# Altium project Tx_Electrode_PA_Power.PrjPcb
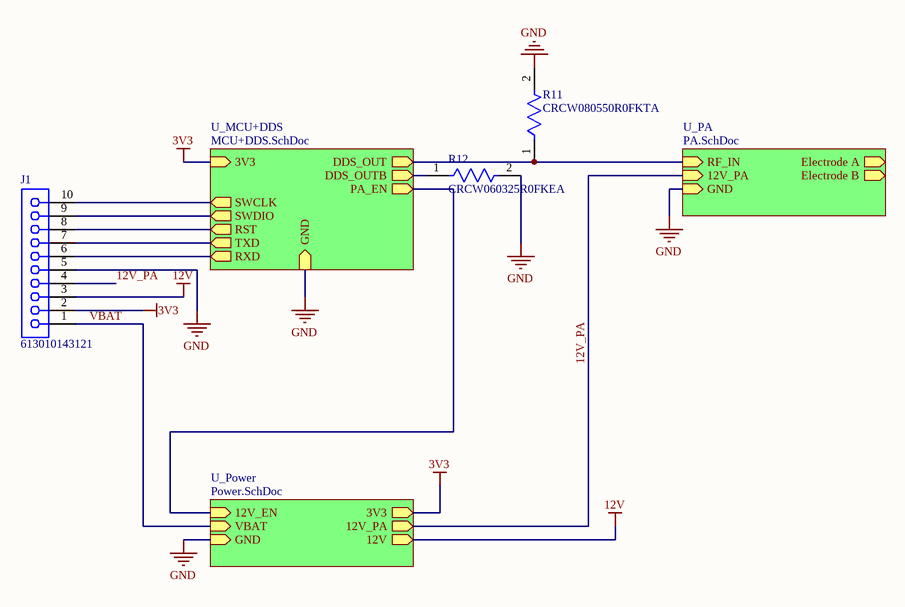
[diagram p0: System.SchDoc]
4 sheets, 65 parts. Net scope: hierarchical (ports join the sheet entries above them; power ports are global).
Board file: PCB1.PcbDoc
Sheets:
  System.SchDoc
    U_PA = PA.SchDoc
    U_MCU+DDS = MCU+DDS.SchDoc
    U_Power = Power.SchDoc

## Sheet System.SchDoc
size A; SheetNumber: 1; SheetTotal: 4

### Parts
J1  613010143121  [613010143121]
R11  CRCW080550R0FKTA  [FP-D12-CRCW0805-MFG]
R12  CRCW060325R0FKEA  [FP-CRCW0603-e3-IPC_B]

### Sub-sheets
U_MCU+DDS = MCU+DDS.SchDoc: 3V3 (in), GND (in), DDS_OUTB (out), DDS_OUT (out), PA_EN (out), SWCLK (out), SWDIO (out), RST (out), TXD (out), RXD (out)
U_PA = PA.SchDoc: RF_IN (in), Electrode A (out), Electrode B (out), 12V_PA (in), GND (in)
U_Power = Power.SchDoc: 12V_EN (in), VBAT (in), 3V3 (out), 12V_PA (out), GND (in), 12V (out)

### Nets
3V3: J1.2 ; sheet U_MCU+DDS/3V3, sheet U_Power/3V3
12V: J1.3 ; sheet U_Power/12V
12V_PA: J1.4 ; sheet U_PA/12V_PA, sheet U_Power/12V_PA
GND: J1.5 R11.2 R12.2 ; sheet U_PA/GND, sheet U_MCU+DDS/GND, sheet U_Power/GND
VBAT: J1.1 ; sheet U_Power/VBAT
DDS_OUT: R11.1 ; sheet U_PA/RF_IN, sheet U_MCU+DDS/DDS_OUT
DDS_OUTB: R12.1 ; sheet U_MCU+DDS/DDS_OUTB
RST: J1.8 ; sheet U_MCU+DDS/RST
RXD: J1.6 ; sheet U_MCU+DDS/RXD
SWCLK: J1.10 ; sheet U_MCU+DDS/SWCLK
SWDIO: J1.9 ; sheet U_MCU+DDS/SWDIO
TXD: J1.7 ; sheet U_MCU+DDS/TXD
NetIC1_3: sheet U_MCU+DDS/PA_EN, sheet U_Power/12V_EN

### Library data of the parts
J1 = CMP-1502-01419-3: NexarPartId: 18818161; Operating Supply Voltage: 250V; Contact Resistance: 20mΩ; Gender: Female; Insulation Resistance: 1GΩ; Connector Type: Header, Socket; Insulation: Insulated; Current Rating: 3A; Number of Positions: 10; Pitch: 2.54mm; Number of Rows: 1; Number of Pins: 10; Voltage Rating: 250V; Length: 25.9mm; Contact Gender: Female; RoHS: Compliant; Contact Plating: Gold; Height: 8.5mm; Min Operating Temperature: -40°C; Contact Material: Copper; Number of Contacts: 10; REACH SVHC: Unknown; Mount: Through Hole; Lead Pitch: 2.54mm; Width: 25.9mm; Max Operating Temperature: 125°C; Flammability Rating: UL94 V-0; Termination: Through Hole; Color: Black; Housing Material: PBT
R11 = CMP-00030-21390498-1: CRCW080550R0FKTA Res Thick Film 0805 50 Ohm 1% 0.125W(1/8W) ±100ppm/C Pad SMD Automotive T/R; Temperature Coefficient: 100ppm/°C; Resistance: 50Ω; Voltage Rating: 150V; Power Rating: 125mW; Length: 2mm; Case Code (Imperial): 0805; Height: 450µm; Contact Plating: Lead, Tin; Width: 1.25mm; Max Operating Temperature: 155°C; NexarPartId: 21390498; Case Code (Metric): 2012; Min Operating Temperature: -55°C; Tolerance: 1%; Case/Package: 0805; Lead Free: Contains Lead; RoHS: Non-Compliant; Composition: Thick Film; Weight: 5.499807mg
R12 = CMP-02407-008643-1: RES Thick Film, 25Ω, 1%, 0.1W, 100ppm/°C, 0603; Resistance: 25R; Power Rating: 100mW; Case/Package: 0603; Lead Free: Lead Free; Tolerance: 1%

## Sheet PA.SchDoc
size A4; SheetNumber: 3; SheetTotal: 4
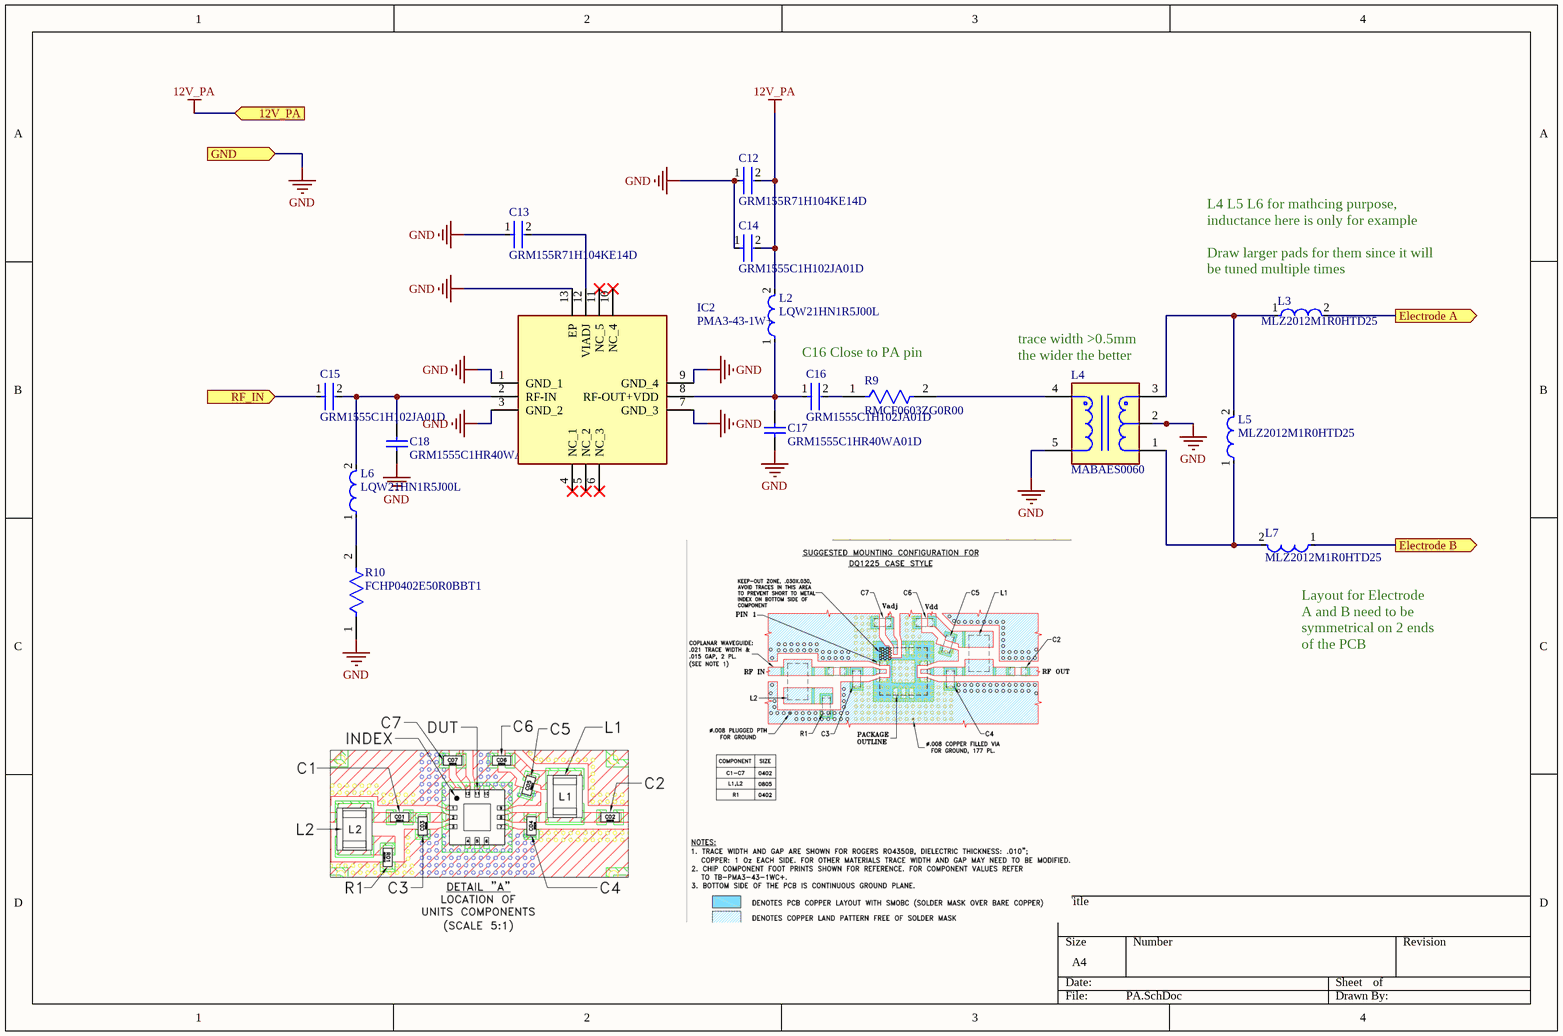
[diagram p1: PA.SchDoc]

### Parts
C12  GRM155R71H104KE14D  [FP-GRM155-0_05-IPC_B]
C13  GRM155R71H104KE14D  [FP-GRM155-0_05-IPC_B]
C14  GRM1555C1H102JA01D  [FP-GRM155-0_05-IPC_B]
C15  GRM1555C1H102JA01D  [FP-GRM155-0_05-IPC_B]
C16  GRM1555C1H102JA01D  [FP-GRM155-0_05-IPC_B]
C17  GRM1555C1HR40WA01D  [CAPC1005X55X25LL05T10]
C18  GRM1555C1HR40WA01D  [CAPC1005X55X25LL05T10]
IC2  PMA3-43-1W+  [QFN51P300X300X89-13N]
L2  LQW21HN1R5J00L  [FP-LQW21HN_00-MFG]
L3  MLZ2012M1R0HTD25  [FP-MLZ2012-1_25-IPC_C]
L4  MABAES0060  [FP-MABAES0060-MFG]
L5  MLZ2012M1R0HTD25  [FP-MLZ2012-1_25-IPC_C]
L6  LQW21HN1R5J00L  [FP-LQW21HN_00-MFG]
L7  MLZ2012M1R0HTD25  [FP-MLZ2012-1_25-IPC_C]
R9  RMCF0603ZG0R00  [FP-RMCF0603-IPC_B]
R10  FCHP0402E50R0BBT1  [FP-FC0402-MFG]

### Ports
12V_PA (in), Electrode A (out), Electrode B (out), GND (in), RF_IN (in)

### Nets
12V_PA: C12.2 C14.2 L2.2 ; port 12V_PA
GND: C12.1 C13.1 C14.1 C17.1 C18.1 IC2.1(GND_1) IC2.3(GND_2) IC2.7(GND_3) IC2.9(GND_4) IC2.13(EP) L4.2(Secondary_CT) L4.5(Primary) R10.1 ; port GND
DDS_OUT: C15.1 ; port RF_IN
NetC13_2: C13.2 IC2.12(VIADJ)
NetC15_2: C15.2 C18.2 IC2.2(RF-IN) L6.2
NetC16_1: C16.1 C17.2 IC2.8(RF-OUT+VDD) L2.1
NetC16_2: C16.2 R9.1
NetL3_1: L3.1 L4.3(Secondary_Dot) L5.2
NetL3_2: L3.2 ; port Electrode A
NetL4_1: L4.1(Secondary) L5.1 L7.2
NetL4_4: L4.4(Primary_dot) R9.2
NetL6_1: L6.1 R10.2
NetL7_1: L7.1 ; port Electrode B

Not connected (* = marked no-connect by the designer): IC2 4(NC_1)* 5(NC_2)* 6(NC_3)* 10(NC_4)* 11(NC_5)*

### Notes on the sheet
- (near L3) L4 L5 L6 for mathcing purpose, inductance here is only for example
  Draw larger pads for them since it will be tuned multiple times
- C16 Close to PA pin
- (near L4) trace width >0.5mm the wider the better
- (near L7) Layout for Electrode A and B need to be symmetrical on 2 ends of the PCB

### Library data of the parts
C12 C13 = CMP-2008-04639-2: Chip Multilayer Ceramic Capacitors for General Purpose, 0402, 0.10uF, X7R, 15%, 10%, 50V; Dissipation Factor: 0.025%; Capacitance: 100nF; Weight: 0.000212oz; Thickness: 0.022inch; Voltage Rating (DC): 50V; Dielectric Material: Ceramic; Termination: SMD/SMT; Case/Package: 0402; Case Code (Imperial): 0402; Mount: Surface Mount; REACH SVHC: No SVHC; Resistor Type: Ceramic; Dielectric: X7R; Max Operating Temperature: 125°C; Voltage: 50V; Lead Free: Lead Free; Package Quantity: 10000; Packaging: Tape and Reel; Length: 1mm; Material: Ceramic; Height: 0.5mm; Depth: 0.5mm; Width: 0.5mm; Min Operating Temperature: -55°C; Tolerance: 10%; Case Code (Metric): 1005; Voltage Rating: 50V
C14-C16 = CMP-2008-04254-2: Chip Multilayer Ceramic Capacitors for General Purpose, 0402, 1000pF, C0G, 30ppm/°C, 5%, 50V; Insulation Resistance: 10GR; Capacitance: 1nF; Packaging: Tape and Reel; Lead Free: Lead Free; Tolerance: 5%; Temperature Coefficient: 30ppm/°C; Thickness: 0.022inch; Termination: SMD/SMT; Max Operating Temperature: 125°C; Height: 0.5mm; Package Quantity: 1; Radiation Hardening: No; Material: Ceramic; Case Code (Metric): 1005; Number of Pins: 2; Voltage Rating: 50V; Mount: Surface Mount; Voltage: 50V; Case/Package: 0402; Min Operating Temperature: -55°C; Dielectric Material: Ceramic; Width: 0.5mm; Depth: 0.5mm; Case Code (Imperial): 0402; REACH SVHC: No SVHC; Dielectric: C0G; Voltage Rating (DC): 50V; Length: 1mm
C17 C18 = CMP-1034-00010-2: Manufacturer: Murata; Part Number: GRM1555C1HR40WA01D
IC2 = PMA3-43-1W+: Integrated Circuit; Manufacturer_Name: Mini-Circuits; Datasheet Link: https://www.minicircuits.com/pdfs/PMA3-43-1W+.pdf; Height: 0.89mm; Manufacturer_Part_Number: PMA3-43-1W+
L2 L6 = CMP-06042-001639-1: Wire Wound Ferrite type RF Inuctor 1.5uH ±5% 85mA 5.33Ω 0805 (2012); DC Resistance (DCR): 5.33R; Self Resonant Frequency: 350MHz; Shielding: Unshielded; Test Frequency: 10MHz; Q Factor: 35; Width: 0.047inch; Core Material: Ferrite; Case Code (Metric): 2012; DC Current: 85mA; Current Rating: 85mA; Mount: Surface Mount; Max DC Current: 85mA; Length: 2mm; Height - Seated (Max): 0.039inch; Depth: 1.4mm; Min Operating Temperature: -40°C; Termination: SMD/SMT; Military Standard: Not; Radiation Hardening: No; Packaging: Tape and Reel; Resistor Type: Wirewound; Case/Package: 0805; Case Code (Imperial): 0805; Inductance: 1.5uH; Weight: 0.000282oz; Height: 0.9mm; Package Quantity: 3000; Max Operating Temperature: 85°C; Tolerance: 5%
L3 L5 L7 = CMP-08253-000383-1: Shielded Multilayer Inductor 1uH ±20% 800mA 130mΩ AEC-Q200 SMD 0805; Core Material: Ferrite; Test Frequency: 2MHz; DC Resistance (DCR): 130mR; Saturation Current: 700mA; Height: 1.25mm; Min Operating Temperature: -55°C; Max DC Current: 800mA; Mount: Surface Mount; Height - Seated (Max): 0.057inch; Tolerance: 20%; Package Quantity: 2000; Case/Package: 0805; Current Rating: 800mA; Inductance: 1uH; Case Code (Metric): 2012; Max Operating Temperature: 125°C; RoHS Compliant: Yes; Case Code (Imperial): 0805; Shielding: Shielded; Ratings: AEC-Q200; Length: 0.079inch; Termination: SMD/SMT; Packaging: Tape and Reel; Width: 0.049inch; Weight: 0.000194oz
L4 = CMP-97513-000003-1: BALUN 300KHZ-200MHZ 1:1 6SMD; Insertion Loss: 1.5dB; Lead/Base Style: Gull Wing; Max DC Current: 500mA; Power Rating: 500mW; Package Quantity: 2000; Lead Free: Lead Free; Case/Package: SMD/SMT; Number of Pins: 5; Width: 3.81mm; Turns Ratio: 1:1; Depth: 3.81mm; Height: 2.67mm; Min Operating Temperature: -40°C; Termination: SMD/SMT; Length: 3.81mm; Max Operating Temperature: 85°C; Packaging: Tape and Reel; Radiation Hardening: No; Mount: Surface Mount
R9 = CMP-26527-006412-1: 0Ω ±0 0.1W 0603 Thick Film Chip Resistor AEC-Q200 compliant; Max Power Dissipation: 100mW; Resistance: 0R; Width: 0.031inch; RoHS Compliant: Yes; Number of Terminations: 2; Case/Package: 0603; Contact Plating: Tin; Height: 0.022inch; Resistor Type: Thick Film; Mount: Surface Mount; Length: 0.061inch; Features: Automotive AEC-Q200; Series: RMCF; Max Operating Temperature: 155°C; Radiation Hardening: No; Min Operating Temperature: -55°C; Packaging: Tape and Reel
R10 = CMP-05494-120702529-1: FCHP0402E50R0BBT1 SMD Chip Resistor, 50 Ohm, ± 0.1%, 1 W, 0402 [1005 Metric], Thin Film, High Frequency; Power Rating: 1W; Voltage Rating: 30V; Temperature Coefficient: 25ppm/°C; Resistance: 50Ω; Max Operating Temperature: 155°C; Min Operating Temperature: -55°C; Composition: Thin Film; Schedule B: 8533210045; Case/Package: 0402; Tolerance: 0.1%; Height: 419.1µm; NexarPartId: 120702529

## Sheet MCU+DDS.SchDoc
size A; SheetNumber: 2; SheetTotal: 4
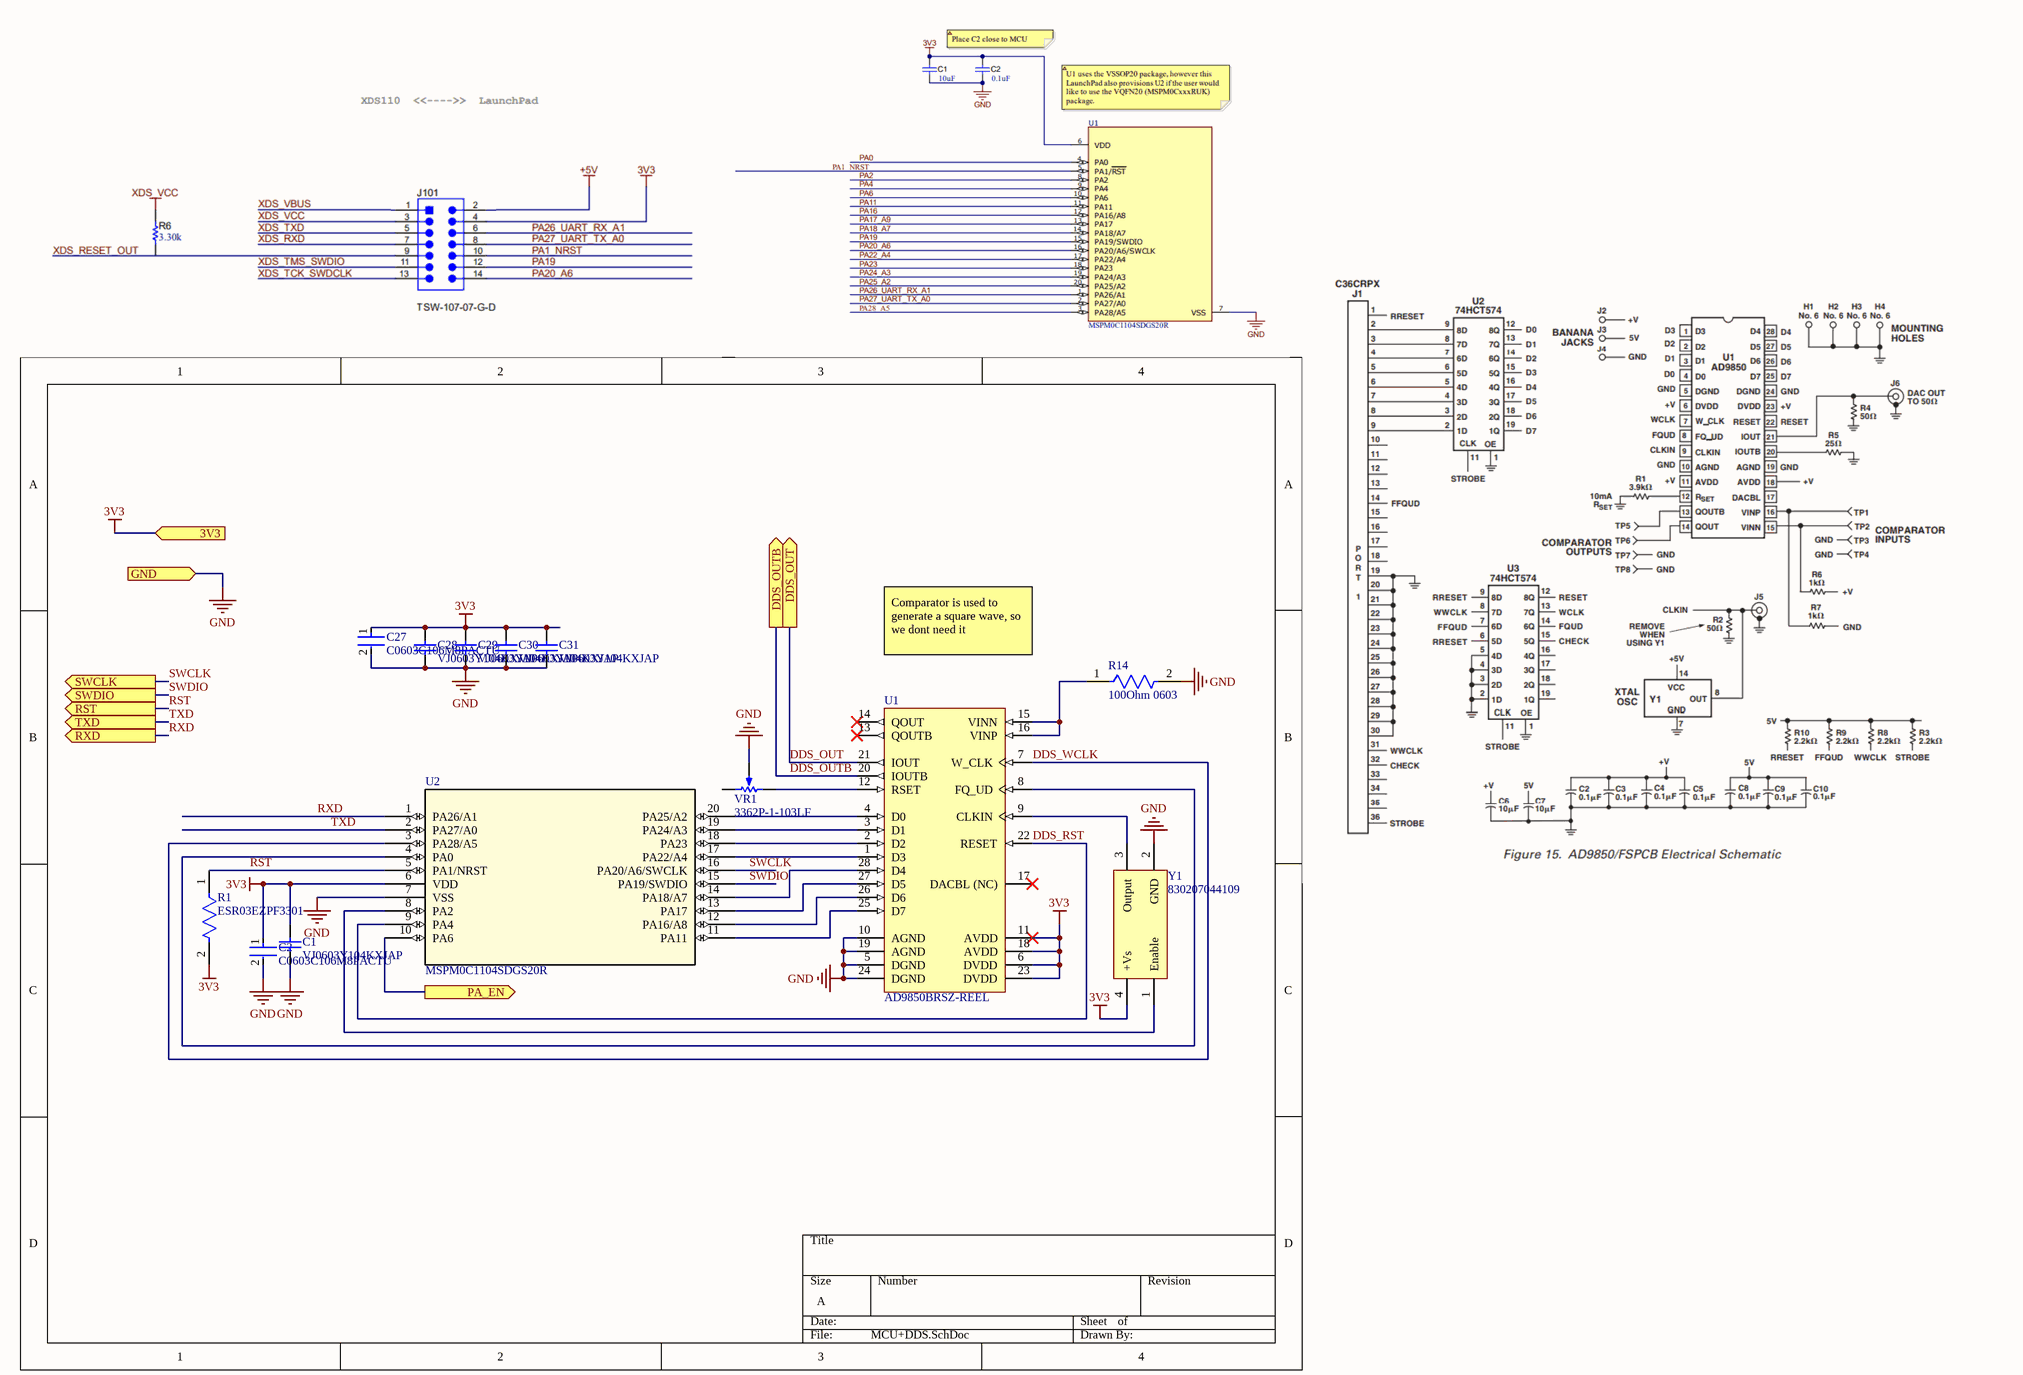
[diagram p2: MCU+DDS.SchDoc]

### Parts
(Parts that share a designator on the sheet are numbered #1, #2 ... from top to bottom, then left to right.)
C1#1  VJ0603Y104KXJAP  [CAPC1608X92X38NL15T08]
C2#1  C0603C106M8PACTU  [FP-C0603C106M8PACTU-MFG]
C27  C0603C106M8PACTU  [FP-C0603C106M8PACTU-MFG]
C28  VJ0603Y104KXJAP  [CAPC1608X92X38NL15T08]
C29  VJ0603Y104KXJAP  [CAPC1608X92X38NL15T08]
C30  VJ0603Y104KXJAP  [CAPC1608X92X38NL15T08]
C31  VJ0603Y104KXJAP  [CAPC1608X92X38NL15T08]
R1#1  ESR03EZPF3301  [FP-ESR03-IPC_A]
R14  100Ohm 0603  [FP-CRCW0603-e3-IPC_B]
U1#1  AD9850BRSZ-REEL  [ADI-RS-28_N]
U2  MSPM0C1104SDGS20R  [DGS0020A_TEX]
VR1  3362P-1-103LF  [BOUR-3362P]
Y1  830207044109  [WE-SPXO_CFPS-39]

### Ports
3V3 (in), DDS_OUT (out), DDS_OUTB (out), GND (in), PA_EN (out), RST (out), RXD (out), SWCLK (out), SWDIO (out), TXD (out)

### Nets
3V3: C1#1.2 C2#1.1 C27.1 C28.2 C29.2 C30.2 C31.2 R1#1.2 U1#1.6(DVDD) U1#1.11(AVDD) U1#1.18(AVDD) U1#1.23(DVDD) U2.6(VDD) Y1.4(+Vs) ; port 3V3
GND: C1#1.1 C2#1.2 C27.2 C28.1 C29.1 C30.1 C31.1 R14.2 U1#1.5(DGND) U1#1.10(AGND) U1#1.19(AGND) U1#1.24(DGND) U2.7(VSS) VR1.2(S) Y1.2(GND) ; port GND
DDS_OUT: U1#1.21(IOUT) ; port DDS_OUT
DDS_OUTB: U1#1.20(IOUTB) ; port DDS_OUTB
DDS_RST: U1#1.22(RESET) U2.9(PA4)
DDS_WCLK: U1#1.7(W_CLK) U2.3(PA28/A5)
RST: R1#1.1 U2.5(PA1/NRST) ; port RST
RXD: U2.1(PA26/A1) ; port RXD
SWCLK: U2.16(PA20/A6/SWCLK) ; port SWCLK
SWDIO: U2.15(PA19/SWDIO) ; port SWDIO
TXD: U2.2(PA27/A0) ; port TXD
NetIC1_3: U2.10(PA6) ; port PA_EN
NetR14_1: R14.1 U1#1.15(VINN) U1#1.16(VINP)
NetU1#1_1: U1#1.1(D3) U2.17(PA22/A4)
NetU1#1_2: U1#1.2(D2) U2.18(PA23)
NetU1#1_3: U1#1.3(D1) U2.19(PA24/A3)
NetU1#1_4: U1#1.4(D0) U2.20(PA25/A2)
NetU1#1_8: U1#1.8(FQ_UD) U2.4(PA0)
NetU1#1_9: U1#1.9(CLKIN) Y1.3(Output)
NetU1#1_12: U1#1.12(RSET) VR1.1(CCW)
NetU1#1_25: U1#1.25(D7) U2.11(PA11)
NetU1#1_26: U1#1.26(D6) U2.12(PA16/A8)
NetU1#1_27: U1#1.27(D5) U2.13(PA17)
NetU1#1_28: U1#1.28(D4) U2.14(PA18/A7)
NetU2_8: U2.8(PA2) Y1.1(Enable)

Not connected (* = marked no-connect by the designer): U1#1 13(QOUTB)* 14(QOUT)* 17(DACBL_(NC))*; VR1 3(CW)

### Notes on the sheet
- Comparator is used to generate a square wave, so we dont need it

### Library data of the parts
C1#1 C28-C31 = CMP-2006-01211-1: Manufacturer: Vitramon; Part Number: VJ0603Y104KXJAP
C2#1 C27 = CMP-03020-034654-1: CAP CER 10UF 10V X5R 0603; RoHS Compliant: Yes
R1#1 = CMP-08839-028747-1: 3.3kΩ ±1% 0.25W 0603 Anti-Surge Chip Resistor AEC-Q200; Temperature Coefficient: 100ppm/°C; Resistance: 3.3kR; Max Power Dissipation: 250mW; Tolerance: 1%; Min Operating Temperature: -55°C; Features: Automotive AEC-Q200; Max Operating Temperature: 155°C; Number of Terminations: 2; Series: ESR; Packaging: Tape and Reel; Resistor Type: Thick Film; RoHS Compliant: Yes; Case/Package: 0603
R14 = CMP-2000-03097-2: Voltage Rating: 75V; Temperature Coefficient: 100ppm/°C; Power Rating: 100mW; Resistance: 22R; Tolerance: 1%; Lead Free: Lead Free; Height: 0.45mm; Package Quantity: 5000; Weight: 7.1E-05oz; Width: 0.85mm; Length: 1.55mm; Mount: Surface Mount; Packaging: Tape and Reel; Termination: SMD/SMT; Case/Package: 0603; Case Code (Metric): 1608; Radiation Hardening: No; Max Operating Temperature: 155°C; Military Standard: Not; Min Operating Temperature: -55°C; Case Code (Imperial): 0603; Contact Plating: Tin; Voltage Rating (DC): 75V; Depth: 0.85mm; Composition: Thick Film
U1#1 = CMP-0293-00041-1: CMOS, 125 MHz Complete DDS Synthesizer, 10-Bit, Parallel, Serial, RS-28, 1500 Reel, Pb-Free; Tuning Word Width (bits): 32bit; Master fclk: 125MHz; Resolution (Bits): 10bit; REFCLK Multiplier: No; Compliance Range (V): 1.5V; FS Iout (mA nom): 20mA; I Supply total (max): 96mA; ComponentLink3Description: Package Specification; Code_JEDEC: MO-150-AH; ComponentLink1URL: www.analog.com; I/O Interface: Parallel, Serial; PackageDescription: 28-Lead Shrink Small Outline Package [SSOP]; ComponentLink2URL: http://www.analog.com/static/imported-files/data_sheets/AD9850.pdf; ComponentLink3URL: http://www.analog.com/static/imported-files/packages/32122249223724RS_28.pdf; ComponentLink2Description: Datasheet; PackageVersion: revA, 1997; ComponentLink1Description: Manufacturer URL; PackageReference: RS-28; DatasheetVersion: Rev. H
U2 = MSPM0C1104SDGS20R: 24MHz ArmÂ® CortexÂ®-M0+ MCU with 16KB flash, 1KB SRAM, 12-bit ADC 20-VSSOP -40 to 125; Manufacturer_Name: Texas Instruments; Copyright: Copyright (C) 2025 Ultra Librarian. All rights reserved.; Manufacturer_Part_Number: MSPM0C1104SDGS20R; Datasheet: https://www.ti.com/lit/gpn/mspm0c1104; RefDes: RefDes; Type: Type
VR1 = CMP-1747-00004-1: Square Trimpot(R) Trimming Potentiometer, 10 KOhm, 300 V, -55 to 125 degC, 3-Pin THD, RoHS, Tube; Voltage Rating: 220 mV; Power Rating: 1 W; Tolerance: 1%; Resistance: 50 mohm; Case/Package: 1206; Length: 3.2 mm; RoHSCompliant: True; PackageDescription: 3-Pin Through Hole Device, Body 6.6 x 6.99 mm, Pitch 2.54 mm; ComponentLink2Description: Datasheet; REACH SVHC: No SVHC; Mount: Surface Mount; Height: 0.6 mm; Packaging: Tape and Reel; ComponentLink1URL: http://www.bourns.com/; Case Code (Imperial): 0612; Pins: 2; Case Code (Metric): 1632; ComponentLink2URL: http://www.bourns.com/docs/Product-Datasheets/3362.pdf; Min Operating Temperature: -25degC; ComponentLink1Description: Manufacturer URL; PackageReference: 3326P; Max Operating Temperature: 125degC; Width: 1.6 mm; Package Quantity: 5000; DatasheetVersion: May-16
Y1 = CMP-03913-116855802-1: 830207044109 WE-SPXO Crystal Oscillator; Frequency: 100MHz; NexarPartId: 116855802; Length: 3.2mm; Width: 2.5mm; Max Operating Temperature: 85°C; Height: 1.2mm; Min Operating Temperature: -40°C

## Sheet Power.SchDoc
size A4; SheetNumber: 4; SheetTotal: 4
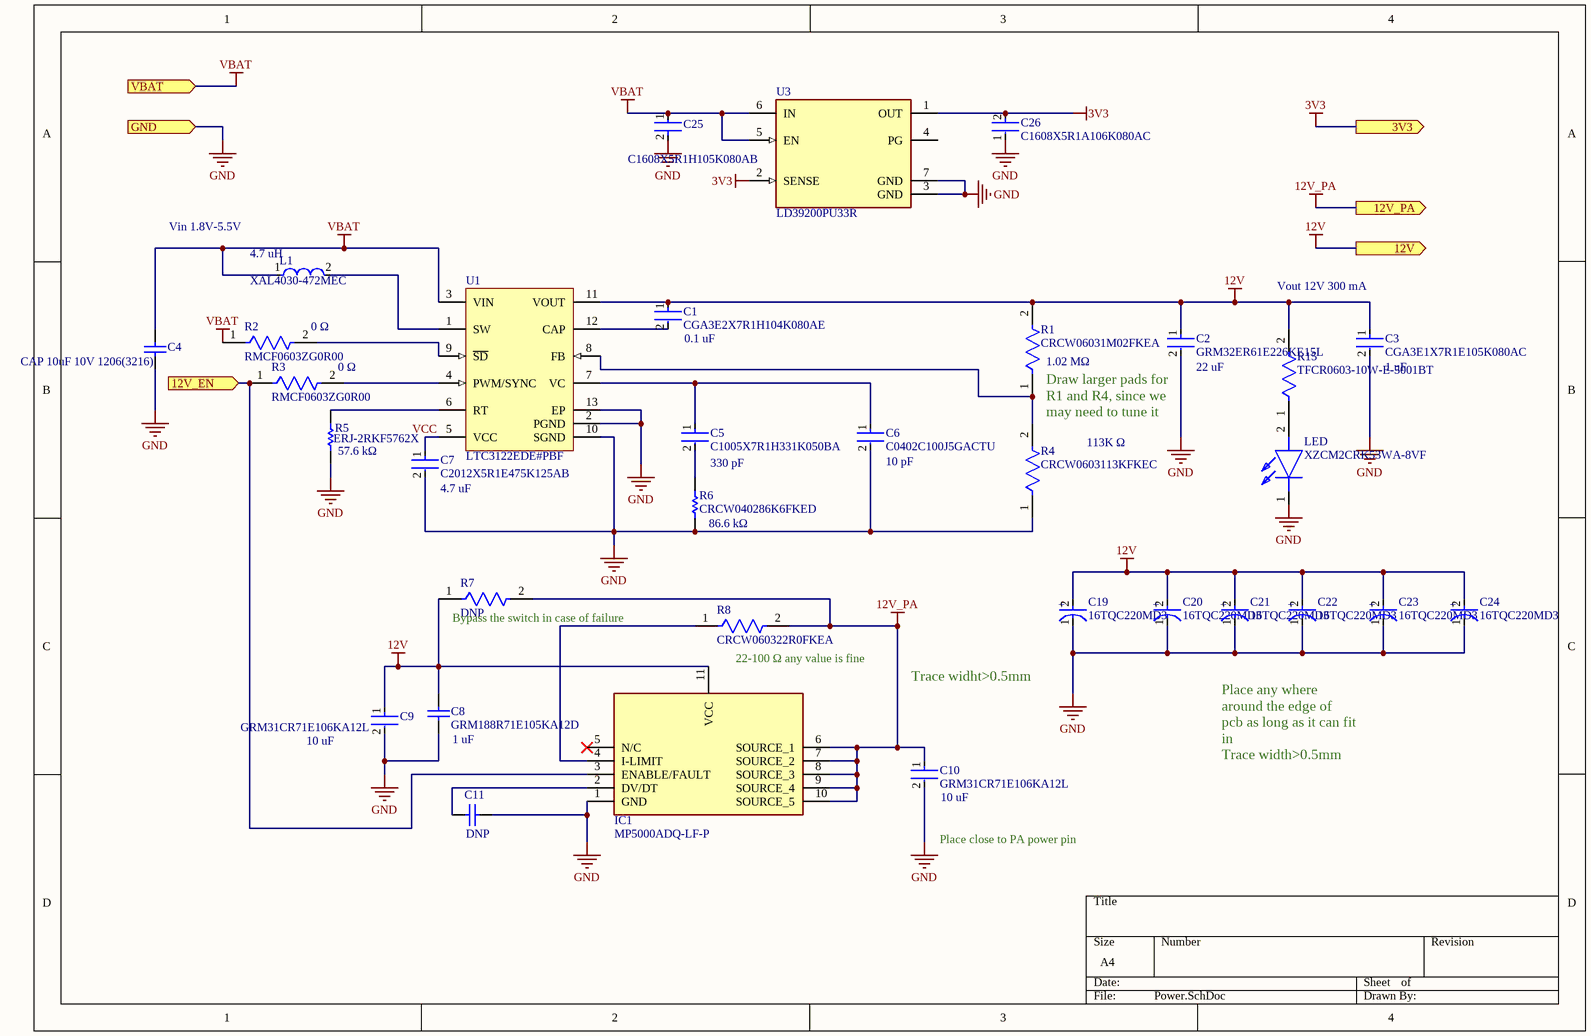
[diagram p3: Power.SchDoc]

### Parts
(Parts that share a designator on the sheet are numbered #1, #2 ... from top to bottom, then left to right.)
C1#2  CGA3E2X7R1H104K080AE  [FP-CGA3E-0_3-0_1-IPC_A]
C2#2  GRM32ER61E226KE15L  [FP-GRM32-MFG]
C3  CGA3E1X7R1E105K080AC  [FP-CGA3E-0_3-0_1-IPC_A]
C4  CAP 10uF 10V 1206(3216)  [CAPC1206(3216)190_L]
C5  C1005X7R1H331K050BA  [FP-C1005-050-0_05-IPC_B]
C6  C0402C100J5GACTU  [FP-C0402-BB-MFG]
C7  C2012X5R1E475K125AB  [FP-C2012-125-0_2-MFG]
C8  GRM188R71E105KA12D  [CAPC1608X90X35ML10T15]
C9  GRM31CR71E106KA12L  [FP-GRM31C-0_2-e0_3_0_8-MFG]
C10  GRM31CR71E106KA12L  [FP-GRM31C-0_2-e0_3_0_8-MFG]
C11  DNP  [CAPC1608X90X35NL10T15]
C19  16TQC220MD3  [FP-POSCAP-D3L-MFG]
C20  16TQC220MD3  [FP-POSCAP-D3L-MFG]
C21  16TQC220MD3  [FP-POSCAP-D3L-MFG]
C22  16TQC220MD3  [FP-POSCAP-D3L-MFG]
C23  16TQC220MD3  [FP-POSCAP-D3L-MFG]
C24  16TQC220MD3  [FP-POSCAP-D3L-MFG]
C25  C1608X5R1H105K080AB  [FP-C1608-080-0_1-IPC_B]
C26  C1608X5R1A106K080AC  [FP-C1608-080-0_1-MFG]
IC1  MP5000ADQ-LF-P  [SON50P300X300X100-11N-D]
L1  XAL4030-472MEC  [FP-XAL4030-472MEC-MFG]
LED  XZCM2CRK53WA-8VF  [XZCFBB53W8VF]
R1#2  CRCW06031M02FKEA  [FP-CRCW0603-e3-IPC_A]
R2  RMCF0603ZG0R00  [FP-RMCF0603-IPC_B]
R3  RMCF0603ZG0R00  [FP-RMCF0603-IPC_B]
R4  CRCW0603113KFKEC  [FP-CRCW0603-e3-MFG]
R5  ERJ-2RKF5762X  [RESC1005X40X25NL05T05]
R6  CRCW040286K6FKED  [RESC1005X40X25NL05T05]
R7  DNP  [FP-RMCF0603-IPC_B]
R8  CRCW060322R0FKEA  [FP-CRCW0603-e3-IPC_B]
R15  TFCR0603-10W-E-5001BT  [FP-TFCR0603-IPC_C]
U1#2  LTC3122EDE#PBF  [LT-DE-UE-12_V]
U3  LD39200PU33R  [FP-DFN6-7946637-MFG]

### Ports
3V3 (out), 12V (out), 12V_EN (in), 12V_PA (out), GND (in), VBAT (in)

### Nets
3V3: C26.2 U3.1(OUT) U3.2(SENSE) ; port 3V3
12V: C1#2.1 C2#2.1 C3.1 C8.2 C9.1 C19.2(A) C20.2(A) C21.2(A) C22.2(A) C23.2(A) C24.2(A) IC1.11(VCC) R1#2.2 R7.1 R15.2 U1#2.11(VOUT) ; port 12V
12V_PA: C10.1 IC1.6(SOURCE_1) IC1.7(SOURCE_2) IC1.8(SOURCE_3) IC1.9(SOURCE_4) IC1.10(SOURCE_5) R7.2 R8.2 ; port 12V_PA
GND: C2#2.2 C3.2 C4.1 C6.2 C7.2 C8.1 C9.2 C10.2 C11.1 C19.1(C) C20.1(C) C21.1(C) C22.1(C) C23.1(C) C24.1(C) C25.2 C26.1 IC1.1(GND) LED.1(K) R4.1 R5.1 R6.1 U1#2.2(PGND) U1#2.10(SGND) U1#2.13(EP) U3.3(GND) U3.7(GND) ; port GND
VBAT: C4.2 C25.1 L1.1 R2.1 U1#2.3(VIN) U3.5(EN) U3.6(IN) ; port VBAT
VCC: C7.1 U1#2.5(VCC)
NetC1#2_2: C1#2.2 U1#2.12(CAP)
NetC5_1: C5.1 C6.1 U1#2.7(VC)
NetC5_2: C5.2 R6.2
NetC11_2: C11.2 IC1.2(DV/DT)
NetIC1_3: IC1.3(ENABLE/FAULT) R3.1 ; port 12V_EN
NetIC1_4: IC1.4(I-LIMIT) R8.1
NetL1_2: L1.2 U1#2.1(SW)
NetLED_2: LED.2(A) R15.1
NetR1#2_1: R1#2.1 R4.2 U1#2.8(FB)
NetR2_2: R2.2 U1#2.9(~{SD})
NetR3_2: R3.2 U1#2.4(PWM/SYNC)
NetR5_2: R5.2 U1#2.6(RT)

Not connected (* = marked no-connect by the designer): IC1 5(N/C)*; U3 4(PG)

### Notes on the sheet
- Vin 1.8V-5.5V
- (near L1) 4.7 uH
- Vout 12V 300 mA
- (near R2) 0 Ω
- (near R3) 0 Ω
- (near C1#2) 0.1 uF
- (near R1#2) 1.02 MΩ
- (near C2#2) 22 uF
- (near C3) 1 uF
- Draw larger pads for R1 and R4, since we may need to tune it
- 113K Ω
- (near R5) 57.6 kΩ
- (near C7) 4.7 uF
- 330 pF
- (near C6) 10 pF
- (near R6) 86.6 kΩ
- (near R7) Bypass the switch in case of failure
- 22-100 Ω any value is fine
- Trace widht>0.5mm
- (near C9) 10 uF
- (near C8) 1 uF
- Place any where around the edge of pcb as long as it can fit in
  Trace width>0.5mm
- Place close to PA power pin
- (near C10) 10 uF
- (in symbol CMP-05428-000297-1) +

### Library data of the parts
C1#2 = CMP-08246-002410-1: Cap Ceramic 100nF 50V X7R 10% Pad SMD 0603 +125°C Automotive T/R; Thickness: 0.035inch; Dielectric: X7R; Height: 0.8mm; Min Operating Temperature: -55°C; Package Quantity: 4000; Voltage Rating: 50V; Voltage Rating (DC): 50V; Lead Free: Lead Free; Case Code (Metric): 1608; Ratings: AEC-Q200; Capacitance: 100nF; Length: 0.063inch; Width: 0.8mm; Weight: 7.1E-05oz; Case/Package: 0603; Case Code (Imperial): 0603; Termination: SMD/SMT; Mount: Surface Mount; Packaging: Tape and Reel; Max Operating Temperature: 125°C; Tolerance: 10%; Features: Soft Termination
C2#2 = CMP-2000-05458-2: CAP CER 22UF 25V X5R 1210; Manufacturer: Murata Electronics North America; Possible Substitute: GRM32ER61E226KE15K; Other Names: 490-3889-2; Material: Ceramic; Tolerance: 10%; Digikey Description: CAP CER 22UF 25V X5R 1210; Mouser Description: Multilayer Ceramic Capacitors MLCC - SMD/SMT 1210 22uF 25volts X5R 10%; Device Class L2: Capacitors; Height: 2.7mm; Temperature Characteristic: X5R; Category: Cap; RoHS: TRUE; Operating Temperature: -55°C ~ 85°C; Temperature: -55°C to +85°C; Lead Free: Yes; Package: GRM32; Temperature Range High: +85°C; Package / Case: 1210 (3225 Metric); Standard Package: 1,000; Packaging: Cut Tape (CT); Capacitance: 22uF; Thickness (Max): 0.106" (2.70mm); Value: 22uF; Automotive: No; Device Class L1: Passive Components; Voltage - Rated: 25V; Temperature Range Low: -55°C; Size / Dimension: 0.126" L x 0.098" W (3.20mm x 2.50mm); ComponentLink2Description: Datasheet; Device Class L3: Ceramic Capacitors; Temperature Coefficient: X5R; ComponentLink2URL: https://search.murata.co.jp/Ceramy/image/img/A01X/G101/ENG/GRM32ER61E226KE15-01A.pdf; Voltage Rating: 25V; Manufacturer Part Number: GRM32ER61E226KE15L; Octopart: https://octopart.com/grm32er61e226ke15l-murata-197441; Applications: General Purpose; Mounting Type: Surface Mount, MLCC
C3 = CMP-08246-001507-1: Cap Ceramic 1uF 25V X7R 10% Pad SMD 0603 +125°C Automotive T/R; Dielectric: X7R; Capacitance: 1uF; Voltage Rating: 25V; Thickness: 0.035inch; Width: 0.031inch; Ratings: AEC-Q200; Case Code (Metric): 1608; REACH SVHC: No SVHC; Voltage: 25V; Composition: Ceramic; Min Operating Temperature: -55°C; Termination: SMD/SMT; Depth: 0.8mm; Max Operating Temperature: 125°C; Mount: Surface Mount; Weight: 7.1E-05oz; Package Quantity: 4000; Tolerance: 10%; Packaging: Tape and Reel; Lead Free: Lead Free; Case/Package: 0603; Length: 1.6mm; Height: 0.8mm; Case Code (Imperial): 0603; Voltage Rating (DC): 25V
C4 = CMP-1037-04967-1: CAP 10uF 10V ±10% 1206 (3216 Metric) Thickness 1.9mm SMD; Tolerance: Â±10%; Case-Metric: 3216; Case-EIA: 1206; Rated Voltage: 10 V; Max Thickness: 1.9 mm; Technology: SMT; Value: 10uF
C5 = CMP-08246-002681-1: Multilayer Ceramic Capacitors 330pF ±10% 50V X7R SMD 0402; Height: 0.5mm; Min Operating Temperature: -55°C; Construction: Flat; Voltage Rating (DC): 50V; Depth: 0.5mm; Number of Pins: 2; Capacitance: 330pF; Case/Package: 0402; REACH SVHC: No SVHC; Lead Free: Lead Free; Thickness: 0.022inch; Package Quantity: 1; Case Code (Imperial): 0402; Max Operating Temperature: 125°C; RoHS Compliant: Yes; Voltage Rating: 50V; Length: 1mm; Weight: 2.3E-05oz; Width: 0.02inch; Case Code (Metric): 1005; Dielectric Material: Ceramic; Tolerance: 10%; Mount: Surface Mount; Dielectric: X7R; Series: C; Resistor Type: Ceramic; Termination: SMD/SMT; Packaging: Tape and Reel
C6 = CMP-2008-03404-2: Multilayer Ceramic Capacitor, C Series, 10 Pf, - 5%, C0G / Np0, 50 V, 0402 [1005 Metric] Rohs Compliant: Yes; Manufacturer: Kemet; Temperature Coefficient: 15%; Voltage Rating: 50 V; Capacitance: 10 pF; Value: 10 pF; Tolerance: 0.05; Automotive: No; Temperature Range High: +125°C; ComponentLink2Description: Datasheet; Manufacturer Part Number: C0402C100J5GACTU; Material: Ceramic; Lead Free: Yes; ComponentLink2URL: https://content.kemet.com/datasheets/KEM_C1002_X7R_SMD.pdf; Device Class L3: Ceramic Capacitors; RoHS: TRUE; Package: C0402-BB; Temperature: -55°C to +125°C; Temperature Range Low: -55°C; Height: 0.55mm; Mouser Description: Multilayer Ceramic Capacitor, C Series, 10 Pf, - 5%, C0G / Np0, 50 V, 0402 [1005 Metric] Rohs Compliant: Yes; Octopart: https://octopart.com/c0402c100j5gactu-kemet-108448; Digikey Description: Multilayer Ceramic Capacitor, C Series, 10 Pf, - 5%, C0G / Np0, 50 V, 0402 [1005 Metric] Rohs Compliant: Yes; Temperature Characteristic: C0G; Category: Cap; Ipc Land Pattern Name: CAPC10050X50; Device Class L1: Passive Components; Device Class L2: Capacitors
C7 = CMP-08246-004908-1: Multilayer Ceramic Capacitors 4.7μF ±10% 25V X5R SMD 0805; Capacitance: 4.7uF; Lead Free: Lead Free; Thickness: 0.057inch; Packaging: Tape and Reel; Min Operating Temperature: -55°C; RoHS Compliant: Yes; Dielectric: X5R; Weight: 0.000194oz; REACH SVHC: No SVHC; Voltage Rating (DC): 25V; Mount: Surface Mount; Resistor Type: Ceramic; Termination: SMD/SMT; Number of Pins: 2; Case Code (Imperial): 0805; Dielectric Material: Ceramic; Voltage: 25V; Voltage Rating: 25V; Case Code (Metric): 2012; Case/Package: 0805; Max Operating Temperature: 85°C; Height: 1.25mm; Tolerance: 10%; Depth: 1.25mm; Package Quantity: 1; Length: 2mm; Radiation Hardening: No; Width: 1.25mm
C8 = CMP-2006-02460-1: Manufacturer: Murata; Part Number: GRM188R71E105KA12D
C9 C10 = CMP-06035-003589-1: Chip Multilayer Ceramic Capacitors for General Purpose, 1206, 10uF, X7R, 15%, 10%, 25V; Case Code (Imperial): 1206; Voltage Rating (DC): 25V; Voltage Rating: 25V; Length: 3.2mm; Lead Free: Lead Free; Thickness: 0.071inch; Package Quantity: 1; Width: 1.6mm; Max Operating Temperature: 125°C; Number of Pins: 2; Height: 1.6mm; Case Code (Metric): 3216; REACH SVHC: No SVHC; Radiation Hardening: No; Case/Package: 1206; Material: Ceramic; Tolerance: 10%; Voltage: 25V; Mount: Surface Mount; Packaging: Tape and Reel; Dielectric: X7R; Termination: SMD/SMT; Min Operating Temperature: -55°C; Capacitance: 10uF; Depth: 1.6mm
C11 = CMP-2006-02680-1: GRM1885C1H560JA01D; Manufacturer: Murata; Part Number: GRM1885C1H560JA01D
C19-C24 = CMP-05428-000297-1: Molded Tantalum Polymer Capacitor 220uF 20% 16V life 2000Hours SMD 2917; RoHS Compliant: Yes
C25 = CMP-2000-06025-2: Multilayer Ceramic Capacitors 1μF ±10% 50V X5R SMD 0603; Capacitance: 1uF; Lead Free: Lead Free; Height: 0.8mm; Mount: Surface Mount; Radiation Hardening: No; Thickness: 0.035inch; Length: 1.6mm; Max Operating Temperature: 85°C; REACH SVHC: No SVHC; Min Operating Temperature: -55°C; Construction: Flat; RoHS Compliant: Yes; Voltage Rating: 50V; Dielectric: X5R; Packaging: Tape and Reel; Termination: SMD/SMT; Voltage Rating (DC): 50V; Case Code (Imperial): 0603; Voltage: 50V; Width: 0.031inch; Weight: 7.1E-05oz; Depth: 0.8mm; Case Code (Metric): 1608; Series: C; Case/Package: 0603; Tolerance: 10%; Resistor Type: Ceramic; Number of Pins: 2; Dielectric Material: Ceramic; Package Quantity: 1
C26 = CMP-2000-04979-3: Multilayer Ceramic Capacitors 10μF ±10% 10V X5R SMD 0603; Capacitance: 10uF; Dielectric Material: Ceramic; Construction: Flat; Height: 0.8mm; Thickness: 0.035inch; Case Code (Metric): 1608; Radiation Hardening: No; Number of Pins: 2; Voltage Rating (DC): 10V; Depth: 0.8mm; Voltage: 10V; RoHS Compliant: Yes; Voltage Rating: 10V; Package Quantity: 1; Resistor Type: Ceramic; Termination: SMD/SMT; Lead Free: Lead Free; REACH SVHC: No SVHC; Tolerance: 10%; Mount: Surface Mount; Series: C; Packaging: Tape and Reel; Width: 0.8mm; Dielectric: X5R; Weight: 7.1E-05oz; Length: 1.6mm; Max Operating Temperature: 85°C; Case Code (Imperial): 0603; Case/Package: 0603; Min Operating Temperature: -55°C
IC1 = MP5000ADQ-LF-P: Integrated Circuit; Manufacturer_Name: Monolithic Power Systems (MPS); Datasheet Link: https://www.monolithicpower.com/en/documentview/productdocument/index/version/2/document_type/Datasheet/lang/en/sku/MP5000A/; Height: 1mm; Manufacturer_Part_Number: MP5000ADQ-LF-P; Mouser Part Number: 946-MP5000ADQ-LF-P; Mouser Price/Stock: https://www.mouser.co.uk/ProductDetail/Monolithic-Power-Systems-MPS/MP5000ADQ-LF-P?qs=%252BZix9lVCYc%252BkK4nDbCRuaQ%3D%3D
L1 = CMP-11268-000082-1: Power Inductor (SMD), 4.7 µH, 5.1 A, Shielded, 4.5 A, XAL40xx Series, 4mm x 4mm x 3.1mm; Tolerance: 20%; DC Resistance (DCR): 44.1mR; Inductance: 4.7uH; Saturation Current: 4.5A; Max DC Current: 5.1A; Self Resonant Frequency: 36MHz; Test Frequency: 100kHz; Core Material: Composite; REACH SVHC: No SVHC; Height: 3.1mm; Package Quantity: 500; Width: 4.3mm; Mount: Surface Mount; RoHS Compliant: Yes; Case/Package: SMD/SMT; Length: 4.3mm; Packaging: Tape and Reel; Max Operating Temperature: 125°C; Min Operating Temperature: -40°C; Series: XAL4030; Termination: SMD/SMT; Inductance Tolerance: 20%; Shielding: Shielded; RMS Current (Irms): 5.1A; Lead Free: Contains Lead
LED = XZCM2CRK53WA-8VF: LED; Manufacturer_Name: SunLED; Datasheet Link: https://datasheet.datasheetarchive.com/originals/distributors/Datasheets_SAMA/e996e994ade8bc327c2da19cfbdeeadc.pdf; Height: 1.1mm; Manufacturer_Part_Number: XZCM2CRK53WA-8VF
R1#2 = CMP-2000-03018-2: RES Thick Film, 1.02MΩ, 1%, 0.1W, 100ppm/°C, 0603; Voltage Rating (DC): 75V; Power Rating: 100mW; Resistance: 1.02MR; Features: Automotive AEC-Q200; Depth: 0.85mm; Max Operating Temperature: 155°C; Tolerance: 1%; Package Quantity: 10; Length: 1.55mm; Mount: Surface Mount; Termination: SMD/SMT; Width: 0.033inch; Temperature Coefficient: 100ppm/°C; Min Operating Temperature: -55°C; Composition: Thick Film; Max Power Dissipation: 100mW; Case Code (Imperial): 0603; Case/Package: 0603; Voltage Rating: 75V; Contact Plating: Tin; Case Code (Metric): 1608; Weight: 7.1E-05oz; Lead Free: Lead Free; Height: 0.02inch; Military Standard: Not; Number of Terminations: 2; Radiation Hardening: No; Packaging: Tape and Reel
R2 R3 = CMP-26527-006412-1: as R9 on sheet PA; Width: 0.031inch; RoHS Compliant: Yes; Number of Terminations: 2; Case/Package: 0603; Contact Plating: Tin; Height: 0.022inch; Resistor Type: Thick Film; Mount: Surface Mount; Length: 0.061inch; Features: Automotive AEC-Q200; Series: RMCF; Max Operating Temperature: 155°C; Radiation Hardening: No; Min Operating Temperature: -55°C; Packaging: Tape and Reel
R4 = CMP-02407-003381-1: RES Thick Film, 113kΩ, 1%, 0.1W, 100ppm/°C, 0603; Power Rating: 100mW; Resistance: 113kR; Packaging: Tape and Reel; Width: 0.033inch; Lead Free: Lead Free; Case/Package: 0603; Height: 0.02inch; Length: 0.061inch; Max Power Dissipation: 100mW; Composition: Thick Film; Tolerance: 1%; Number of Terminations: 2; Max Operating Temperature: 155°C; Min Operating Temperature: -55°C; Temperature Coefficient: 100ppm/°C; Features: Automotive AEC-Q200; Package Quantity: 20000
R5 = CMP-2002-01001-1: Manufacturer: Panasonic; Part Number: ERJ-2RKF5762X
R6 = CMP-2002-00247-1: Manufacturer: Vishay Dale; Part Number: CRCW040286K6FKED
R7 = CMP-26527-006412-1: Max Power Dissipation: 100mW; Resistance: 0R; Width: 0.031inch; RoHS Compliant: Yes; Number of Terminations: 2; Case/Package: 0603; Contact Plating: Tin; Height: 0.022inch; Resistor Type: Thick Film; Mount: Surface Mount; Length: 0.061inch; Features: Automotive AEC-Q200; Series: RMCF; Max Operating Temperature: 155°C; Radiation Hardening: No; Min Operating Temperature: -55°C; Packaging: Tape and Reel
R8 = CMP-2000-03097-2: RES Thick Film, 22Ω, 1%, 0.1W, 100ppm/°C, 0603; Voltage Rating: 75V; Power Rating: 100mW; Resistance: 22R; Lead Free: Lead Free; Height: 0.45mm; Package Quantity: 5000; Weight: 7.1E-05oz; Width: 0.85mm; Length: 1.55mm; Mount: Surface Mount; Packaging: Tape and Reel; Termination: SMD/SMT; Temperature Coefficient: 100ppm/°C; Case/Package: 0603; Case Code (Metric): 1608; Radiation Hardening: No; Max Operating Temperature: 155°C; Military Standard: Not; Min Operating Temperature: -55°C; Case Code (Imperial): 0603; Contact Plating: Tin; Voltage Rating (DC): 75V; Tolerance: 1%; Depth: 0.85mm; Composition: Thick Film
R15 = CMP-250906-228113-1: RES Thin Film,  4kΩ, 0.1%, 0.1W, 25ppm/°C, 0603
U1#2 = CMP-0492-00369-1: 2.5 A Synchronous Step-Up DC/DC Converter with Output Disconnect, 12-pin SON (DE-UE-12), -40 to 125 degC, Pb-Free; Manufacturer: Linear Technology; Number of Outputs: 1; ComponentLink2URL: http://cds.linear.com/docs/en/datasheet/3122fa.pdf; ComponentLink1URL: http://www.linear.com/; Code_JEDEC: MO-229; ComponentLink2Description: Datasheet; ComponentLink1Description: Manufacturer URL; PackageReference: DE-UE-12; PackageVersion: Rev. D, 06/2010; ComponentLink3Description: Package Specification; PackageDescription: 12-Pin Plastic DFN, Body 4 x 3 mm, Pitch 0.5 mm; PartNumber: LTC3122EDE#PBF; ComponentLink3URL: http://cds.linear.com/docs/en/packaging/DFN_12_05-08-1695.pdf; Mounting Technology: Surface Mount; RoHS: TRUE; DatasheetVersion: Rev. A
U3 = CMP-12153-000011-1: IC REG LINEAR 3.3V 2A 6DFN; Number of Outputs: 1; Max Input Voltage: 6V; Output Type: Fixed; Min Input Voltage: 1.25V; Dropout Voltage: 130mV; Operating Supply Current: 1mA; Number of Regulators: 1; Case/Package: DFN; Packaging: Tape and Reel; Output Current: 2A; Min Operating Temperature: -40°C; Mount: Surface Mount; Output Voltage: 3.3V; Max Operating Temperature: 125°C; Lead Free: Lead Free; Package Quantity: 3000

## Nets that join several sheets
3V3: System (J1.2), MCU+DDS (14 pins), Power (C26.2 U3.1 U3.2)
12V: System (J1.3), Power (16 pins)
12V_PA: System (J1.4), PA (C12.2 C14.2 L2.2), Power (8 pins)
GND: System (J1.5 R11.2 R12.2), PA (13 pins), MCU+DDS (15 pins), Power (27 pins)
VBAT: System (J1.1), Power (7 pins)
DDS_OUT: System (R11.1), PA (C15.1), MCU+DDS (U1#1.21)
DDS_OUTB: System (R12.1), MCU+DDS (U1#1.20)
NetIC1_3: MCU+DDS (U2.10), Power (IC1.3 R3.1)
RST: System (J1.8), MCU+DDS (R1#1.1 U2.5)
RXD: System (J1.6), MCU+DDS (U2.1)
SWCLK: System (J1.10), MCU+DDS (U2.16)
SWDIO: System (J1.9), MCU+DDS (U2.15)
TXD: System (J1.7), MCU+DDS (U2.2)